# Altium schematic sheet Sheet1.SchDoc
size A4
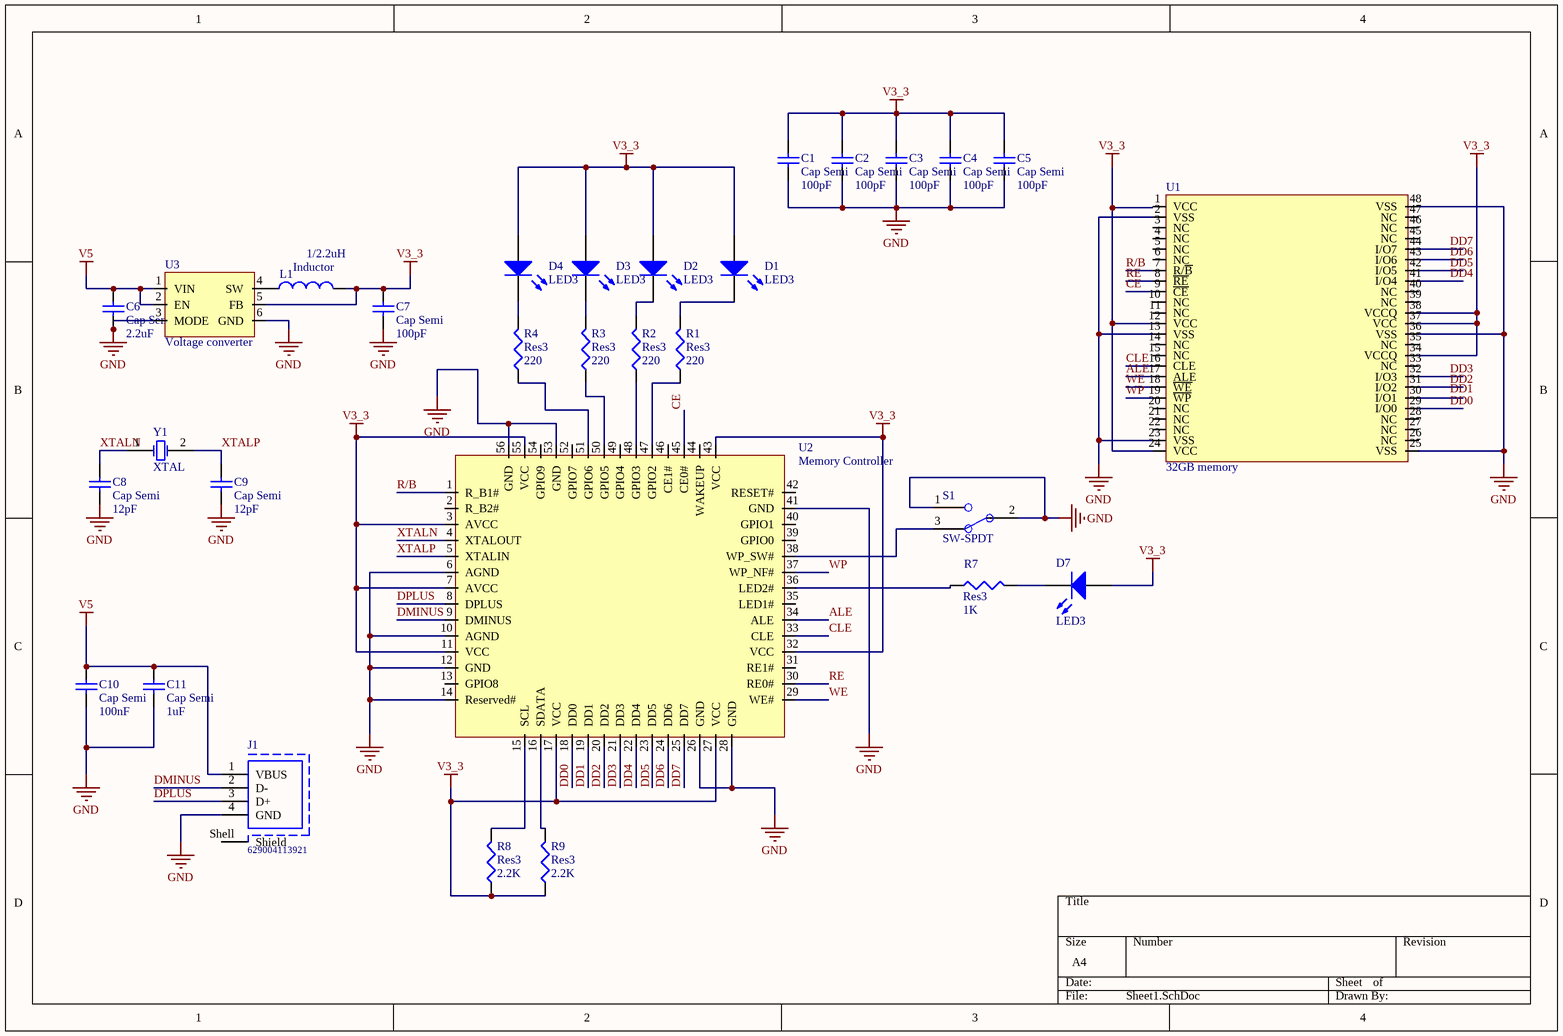
[diagram p0: Sheet1.SchDoc]

## Parts
C1  Cap Semi  value 100pF  [CAPC3216L]
C2  Cap Semi  value 100pF  [CAPC3216L]
C3  Cap Semi  value 100pF  [CAPC3216L]
C4  Cap Semi  value 100pF  [CAPC3216L]
C5  Cap Semi  value 100pF  [CAPC3216L]
C6  Cap Semi  value 2.2uF  [CAPC3216L]
C7  Cap Semi  value 100pF  [CAPC3216L]
C8  Cap Semi  value 12pF  [CAPC3216L]
C9  Cap Semi  value 12pF  [CAPC3216L]
C10  Cap Semi  value 100nF  [CAPC3216L]
C11  Cap Semi  value 1uF  [CAPC3216L]
D1  LED3  [DSO-C2/D5.6]
D2  LED3  [DSO-C2/D5.6]
D3  LED3  [DSO-C2/D5.6]
D4  LED3  [DSO-C2/D5.6]
D7  LED3  [DSO-C2/D5.6]
J1  629004113921  [629004113921]
L1  Inductor  value 1/2.2uH  [INDC1005AL]
R1  Res3  value 220  [RESC1608L]
R2  Res3  value 220  [RESC1608L]
R3  Res3  value 220  [RESC1608L]
R4  Res3  value 220  [RESC1608L]
R7  Res3  value 1K  [RESC1608L]
R8  Res3  value 2.2K  [RESC1608L]
R9  Res3  value 2.2K  [RESC1608L]
S1  SW-SPDT  [SW-SPDT]
U1  32GB memory  [TSSOP50P2000X120-48N]
U2  Memory Controller  [QFN50P800X800X100-56N]
U3  Voltage converter  [USON]
Y1  XTAL  [BCY-W2/D3.1]

## Nets
GND: C1.1 C2.1 C3.1 C4.1 C5.1 C6.2 C7.1 C8.1 C9.1 C10.1 C11.1 J1.4(GND) S1.1 S1.2 U1.2(VSS) U1.13(VSS) U1.23(VSS) U1.25(VSS) U1.36(VSS) U1.48(VSS) U2.6(AGND) U2.10(AGND) U2.12(GND) U2.14(Reserved#) U2.26(GND) U2.28(GND) U2.41(GND) U2.53(GND) U2.56(GND) U3.3(MODE) U3.6(GND)
V3_3: C1.2 C2.2 C3.2 C4.2 C5.2 C7.2 D1.1(A) D2.1(A) D3.1(A) D4.1(A) D7.1(A) L1.2 R8.1 R9.1 U1.12(VCC) U1.24(VCC) U1.34(VCCQ) U1.37(VCC) U1.38(VCCQ) U2.3(AVCC) U2.7(AVCC) U2.11(VCC) U2.17(VCC) U2.27(VCC) U2.32(VCC) U2.43(VCC) U2.55(VCC) U3.5(FB)
V5: C6.1 C10.2 C11.2 J1.1(VBUS) U3.1(VIN) U3.2(EN)
ALE: U1.17(ALE) U2.34(ALE)
CE: U1.9(~{CE}) U2.45(CE0#)
CLE: U1.16(CLE) U2.33(CLE)
DD0: U1.29(I/O0) U2.18(DD0)
DD1: U2.19(DD1)
DD2: U1.31(I/O2) U2.20(DD2)
DD3: U1.32(I/O3) U2.21(DD3)
DD4: U1.41(I/O4) U2.22(DD4)
DD5: U1.42(I/O5)
DD6: U1.43(I/O6) U2.24(DD6)
DD7: U1.44(I/O7) U2.25(DD7)
DMINUS: J1.2(D-) U2.9(DMINUS)
DPLUS: J1.3(D+) U2.8(DPLUS)
R/B: U1.7(R/~{B}) U2.1(R_B1#)
RE: U1.8(~{RE}) U2.30(RE0#)
WE: U1.18(~{WE}) U2.29(WE#)
WP: U1.19(~{WP}) U2.37(WP_NF#)
XTALN: C8.2 U2.4(XTALOUT) Y1.1(OSC1)
XTALP: C9.2 U2.5(XTALIN) Y1.2(OSC2)
NetD1_2: D1.2(K) R1.2
NetD2_2: D2.2(K) R2.2
NetD3_2: D3.2(K) R3.2
NetD4_2: D4.2(K) R4.2
NetD7_2: D7.2(K) R7.2
NetL1_1: L1.1 U3.4(SW)
NetR1_1: R1.1 U2.47(GPIO2)
NetR2_1: R2.1 U2.48(GPIO3)
NetR3_1: R3.1 U2.50(GPIO5)
NetR4_1: R4.1 U2.51(GPIO6)
NetR7_1: R7.1 U2.36(LED2#)
NetR8_2: R8.2 U2.15(SCL)
NetR9_2: R9.2 U2.16(SDATA)
NetS1_3: S1.3 U2.38(WP_SW#)

Not connected (* = marked no-connect by the designer): J1 Shell(Shield); U1 1(VCC) 3(NC) 4(NC) 5(NC) 6(NC) 10(NC) 11(NC) 14(NC) 15(NC) 20(NC) 21(NC) 22(NC) 26(NC) 27(NC) 28(NC) 30(I/O1) 33(NC) 35(NC) 39(NC) 40(NC) 45(NC) 46(NC) 47(NC); U2 2(R_B2#) 13(GPIO8) 23(DD5) 31(RE1#) 35(LED1#) 39(GPIO0) 40(GPIO1) 42(RESET#) 44(WAKEUP) 46(CE1#) 49(GPIO4) 52(GPIO7) 54(GPIO9)

## Notes on the sheet
- Labels drawn without touching a wire or pin: DD1, DD5

## Library data of the parts
C1-C11 = Cap Semi: Capacitor (Semiconductor SIM Model); Published: 8-Jun-2000; LatestRevisionDate: 29-May-2009; LatestRevisionNote: IPC-7351 Footprint Added.; PackageReference: C1206; Publisher: Altium Limited; PackageDescription: Chip Capacitor
D1-D4 D7 = LED3: Typical BLUE SiC LED; Published: 8-Jun-2000; LatestRevisionDate: 17-Dec-2003; LatestRevisionNote: PCB Footprint replaced.; DatasheetVersion: 16-Apr-2002; PackageVersion: 16-Apr-2002; PackageReference: 3.5X2.8X1.9; Publisher: Altium Limited
J1 = 629004113921: USB 2.0 Type A Plug WR-COM, Horizontal, SMT, with Clips; Rated Current: 1.5 A; Contact Resistance: 20 mOhm; Working Voltage: 30 VAC; ComponentLink1Description: Manufacturer; ComponentLink1URL: http://www.we-online.de; ComponentLink2Description: Datasheet; ComponentLink2URL: https://katalog.we-online.de/em/datasheet/629004113921.pdf; Part Number: 629004113921; Published Date: September 2018; Publisher: Wurth Elektronik; Orientation: Horizontal; Connector Type: USB 2.0 Type A; Operating Temperature: -40 to 105 degC; Mounting Technology: SMT; Gender: Plug; Packaging: Tube
L1 = Inductor: Code_IEC: 1005; Published: 8-Jun-2000; LatestRevisionDate: 29-May-2009; LatestRevisionNote: IPC-7351 Footprint Added.; PackageReference: 0402-A; Publisher: Altium Limited; PackageDescription: Chip Inductor; Code_JEITA: 0402
R1-R4 R7-R9 = Res3: Resistor; Published: 8-Jun-2000; LatestRevisionDate: 29-May-2009; LatestRevisionNote: IPC-7351 Footprint Added.; PackageReference: J1-0603; Publisher: Altium Limited; PackageDescription: Chip Resistor
S1 = Component_4
U1 = Component_2
U2 = Component_1
U3 = Component_3
Y1 = XTAL: Crystal Oscillator; Published: 8-Jun-2000; LatestRevisionDate: 17-Jul-2002; LatestRevisionNote: Re-released for DXP Platform.; PackageReference: R38; Publisher: Altium Limited